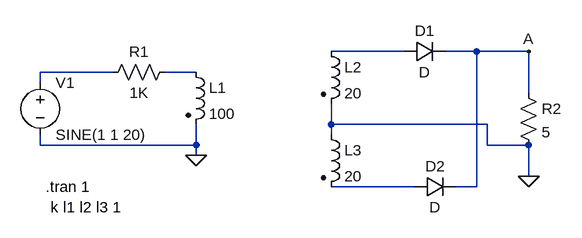
[diagram p0: schematic Full-wave Rectifier.asc]
Full-wave Rectifier.asc, the LTspice schematic file:
Version 4
SHEET 1 880 680
WIRE 304 64 192 64
WIRE 416 64 368 64
WIRE 496 64 416 64
WIRE -144 96 -256 96
WIRE -16 96 -64 96
WIRE -256 112 -256 96
WIRE 496 128 496 64
WIRE 192 176 192 144
WIRE 432 176 192 176
WIRE 192 192 192 176
WIRE -256 208 -256 192
WIRE -16 208 -16 176
WIRE -16 208 -256 208
WIRE 432 208 432 176
WIRE 496 208 432 208
WIRE -16 224 -16 208
WIRE 496 256 496 208
WIRE 320 272 192 272
WIRE 416 272 416 64
WIRE 416 272 384 272
FLAG -16 224 0
FLAG 496 256 0
FLAG 496 64 A
SYMBOL ind2 -32 80 R0
SYMATTR InstName L1
SYMATTR Value 100
SYMATTR Type ind
SYMBOL ind2 176 48 R0
SYMATTR InstName L2
SYMATTR Value 20
SYMATTR Type ind
SYMBOL ind2 176 176 R0
SYMATTR InstName L3
SYMATTR Value 20
SYMATTR Type ind
SYMBOL res -48 80 R90
WINDOW 0 0 56 VBottom 2
WINDOW 3 32 56 VTop 2
SYMATTR InstName R1
SYMATTR Value 1K
SYMBOL voltage -256 96 R0
WINDOW 123 0 0 Left 0
WINDOW 39 0 0 Left 0
SYMATTR InstName V1
SYMATTR Value SINE(1 1 20)
SYMBOL diode 304 80 R270
WINDOW 0 32 32 VTop 2
WINDOW 3 0 32 VBottom 2
SYMATTR InstName D1
SYMBOL diode 320 288 R270
WINDOW 0 32 32 VTop 2
WINDOW 3 0 32 VBottom 2
SYMATTR InstName D2
SYMBOL res 480 112 R0
SYMATTR InstName R2
SYMATTR Value 5
TEXT -248 272 Left 2 !.tran 1
TEXT -240 304 Left 2 !k l1 l2 l3 1

The netlist it stands for:
* Full-wave Rectifier.asc
L1 N003 0 100
L2 N001 0 20
L3 0 N004 20
R1 N003 N002 1K
V1 N002 0 SINE(1 1 20)
D1 N001 A D
D2 N004 A D
R2 A 0 5
.model D D
.lib standard.dio
.tran 1
k l1 l2 l3 1
.backanno
.end